# EAGLE design LM393 universal breakout (EAGLE 7.3.0)
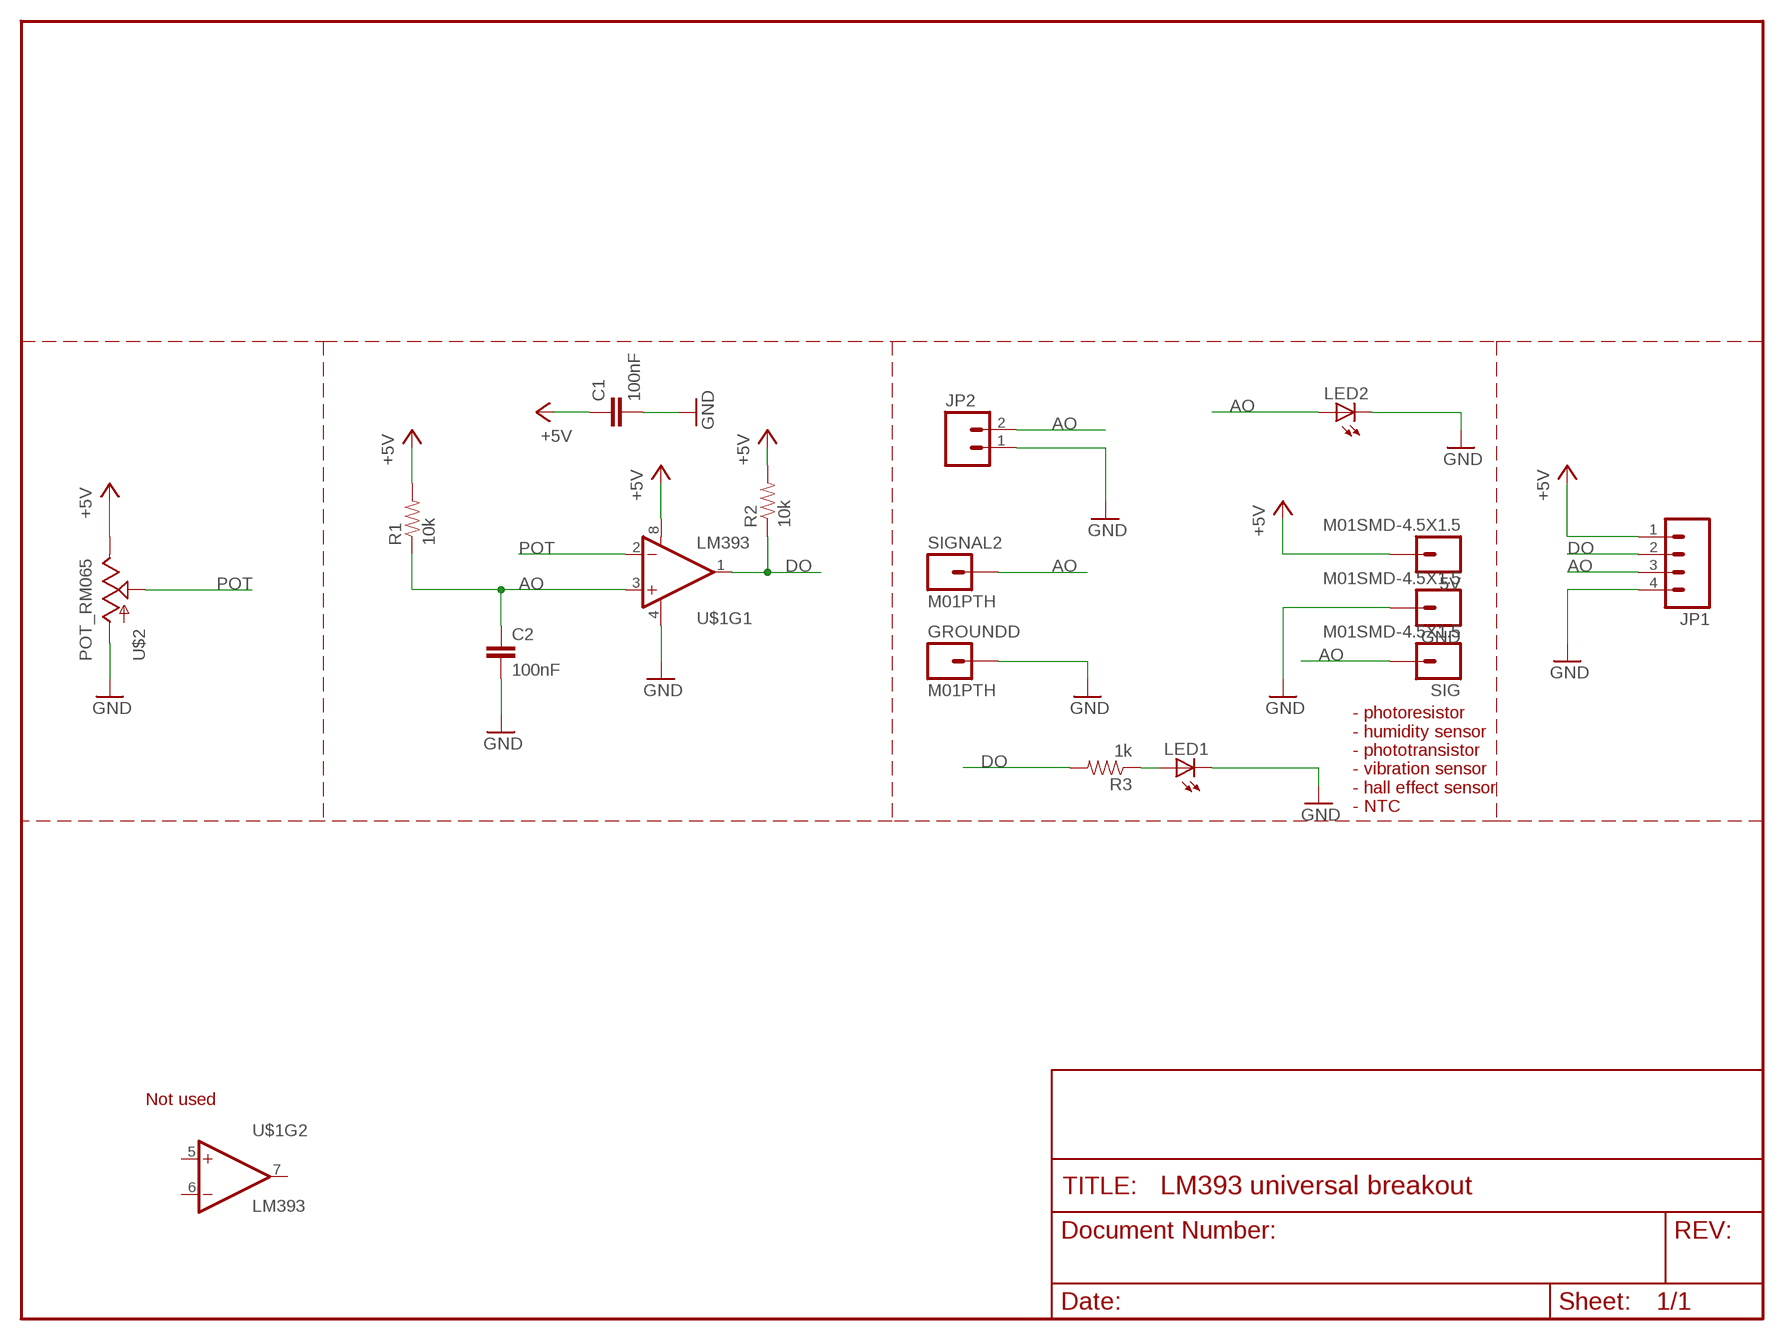
[diagram p0: schematic, sheet 1]

## Parts
5V  M01SMD-4.5X1.5  [PAD-1.5X4.5]
C1  100nF  CAP0603-CAP  [0603-CAP]
C2  100nF  CAP0603-CAP  [0603-CAP]
GND  M01SMD-4.5X1.5  [PAD-1.5X4.5]
GROUNDD  M01PTH  [1X01]
JP1  M04PTH  [1X04]
JP2  M02PTH  [1X02]
LED1  LEDCHIP-LED0805  [CHIP-LED0805]
LED2  LED5MM  [LED5MM]
R1  10k  RESISTOR0603-RES  [0603-RES]
R2  10k  RESISTOR0603-RES  [0603-RES]
R3  1k  RESISTOR0603-RES  [0603-RES]
SIG  M01SMD-4.5X1.5  [PAD-1.5X4.5]
SIGNAL2  M01PTH  [1X01]
U$1  LM393  [SO08]
U$2  POT_RM065  [RM065]

## Nets
+5V: 5V.P$1 C1.1 JP1.1 R1.2 R2.2 U$1.8(V+) U$2.3(E)
AO: C2.1 JP1.3 JP2.2 LED2.A R1.1 SIG.P$1 SIGNAL2.1 U$1.3(+IN)
DO: JP1.2 R2.1 R3.2 U$1.1(OUT)
GND: C1.2 C2.2 GND.P$1 GROUNDD.1 JP1.4 JP2.1 LED1.C LED2.K(C) U$1.4(V-) U$2.1(A)
N$1: LED1.A R3.1
POT: U$1.2(-IN) U$2.2(S)
Unconnected: U$1.5(+IN) U$1.6(-IN) U$1.7(OUT)

## Notes on the sheet
- - photoresistor
  - humidity sensor
  - phototransistor
  - vibration sensor
  - hall effect sensor
  - NTC
- Not used

## Library data of the parts
5V GND GROUNDD SIG SIGNAL2 = SparkFun:M01: Header 1 Standard 1-pin 0.1" header. Use with straight break away headers (SKU : PRT-00116), right angle break away headers (PRT-00553), swiss pins (PRT-00743), machine pins (PRT-00117), and female headers (PRT-00115).
C1 C2 = SparkFun:CAP: Capacitor Standard 0603 ceramic capacitor, and 0.1" leaded capacitor.
JP1 = SparkFun:M04: Header 4 Standard 4-pin 0.1" header. Use with straight break away headers (SKU : PRT-00116), right angle break away headers (PRT-00553), swiss pins (PRT-00743), machine pins (PRT-00117), and female headers (PRT-00115). Molex polarized connector foot print use with SKU : PRT-08231 with associated crimp pins and housings. 1MM SMD Version SKU: PRT-10208
JP2 = SparkFun:M02: Header 2 Standard 2-pin 0.1" header. Use with straight break away headers (SKU : PRT-00116), right angle break away headers (PRT-00553), swiss pins (PRT-00743), machine pins (PRT-00117), and female headers (PRT-00115). Molex polarized connector foot print use with SKU : PRT-08233 with associated crimp pins and housings.
LED1 LED2 = adafruit:LED: LED OSRAM: - CHIPLED LG R971, LG N971, LY N971, LG Q971, LY Q971, LO R971, LY R971 LH N974, LH R974 LS Q976, LO Q976, LY Q976 LO Q996 - Hyper CHIPLED LW Q18S LB Q993, LB Q99A, LB R99A - SideLED LS A670, LO A670, LY A670, LG A670, LP A670 LB A673, LV A673, LT A673, LW A673 LH A674 LY A675 LS A676, LA A676, LO A676, LY A676, LW A676 LS A679, LY A679, LG A679 - Hyper Micro SIDELED® LS Y876, LA Y876, LO Y876, LY Y876 LT Y87S - SmartLED LW L88C, LW L88S LB L89C, LB L89S, LG L890 LS L89K, LO L89K, LY L89K LS L896, LA L896, LO L896, LY L896 - TOPLED LS T670, LO T670, LY T670, LG T670, LP T670 LSG T670, LSP T670, LSY T670, LOP T670, LYG T670 LG T671, LOG T671, LSG T671 LB T673, LV T673, LT T673, LW T673 LH T674 LS T676, LA T676, LO T676, LY T676, LB T676, LH T676, LSB T676, LW T676 LB T67C, LV T67C, LT T67C, LS T67K, LO T67K, LY T67K, LW E67C LS E67B, LA E67B, LO E67B, LY E67B, LB E67C, LV E67C, LT E67C LW T67C LS T679, LY T679, LG T679 LS T770, LO T770, LY T770, LG T770, LP T770 LB T773, LV T773, LT T773, LW T773 LH T774 LS E675, LA E675, LY E675, LS T675 LS T776, LA T776, LO T776, LY T776, LB T776 LHGB T686 LT T68C, LB T68C - Hyper Mini TOPLED® LB M676 - Mini TOPLED Santana® LG M470 LS M47K, LO M47K, LY M47K Source: http://www.osram.convergy.de/
R1-R3 = SparkFun:RESISTOR: Resistor Basic schematic elements and footprints for 0603, 1206, and PTH resistors.
U$1 = SparkFun:LM393
U$2 = SparkFun:POT_RM065

## Board
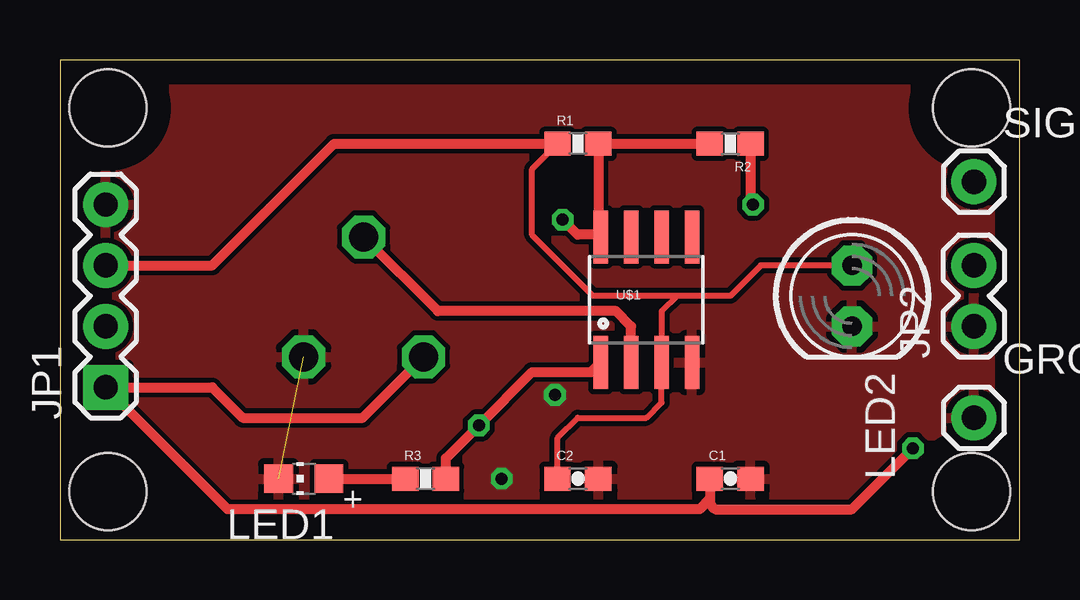
[diagram p1: board, top side]
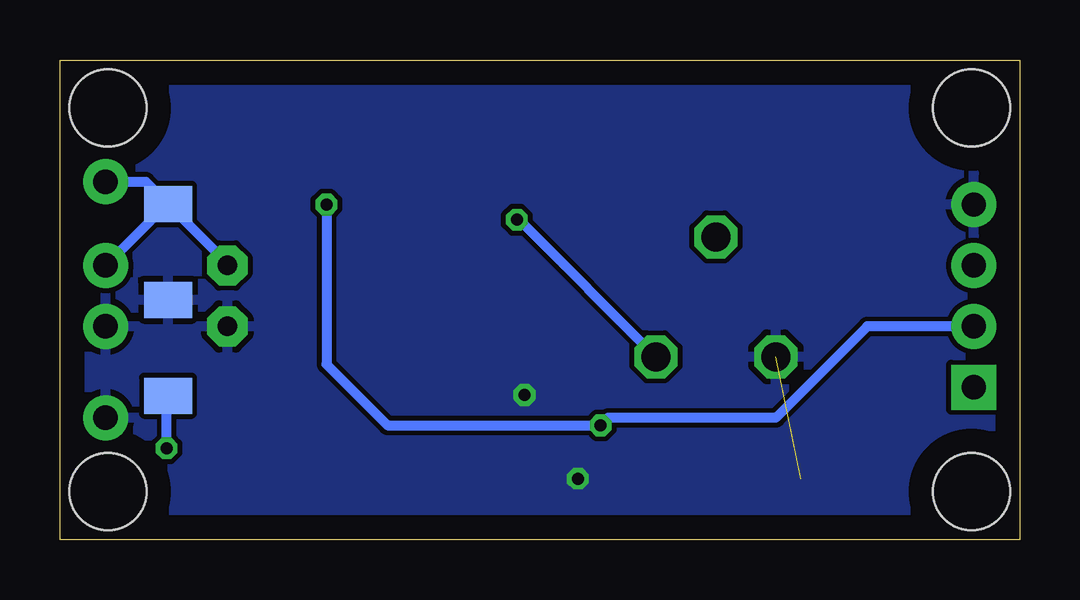
[diagram p2: board, bottom side, seen from below]

Size 40 x 20 mm. Coordinates in mm from the lower left corner, seen from the top.
Outline: 0,0 40,0 40,20 0,20 0,0
Copper layers (1*16): Top 0.035mm / dielectric 1.5mm / Bottom 0.035mm
Design rules "default *": minimum track width 10mil, minimum drill 24mil, track to track 8mil, track to pad 8mil, pad to pad 8mil, via to via 8mil, smd to smd 8mil, copper to edge 40mil, drill to drill 8mil, minimum pad ring 10mil, minimum via ring 8mil, stop-mask expansion 4mil, vias tented up to drill 5mm, thermal gap 10mil
Holes 3.2 mm at 2,2 2,18 38,18 38,2

### Footprints (pad centres in the part's own frame; a part is rotated, then mirrored left to right if it is on the bottom)
PAD-1.5X4.5 = smd 1.5 x 2: P$1 0,0
0603-CAP = smd 1.1 x 1: 1 -0.85,0; 2 0.85,0
1X01 = drill 1.016 pad 1.88: 1 0,0
1X04 = drill 1.016 pad 1.88 square: 1 0,0 | drill 1.016 pad 1.88: 2 2.54,0; 3 5.08,0; 4 7.62,0
1X02 = drill 1.016 pad 1.88: 1 0,0; 2 2.54,0
CHIP-LED0805 = smd 1.2 x 1.2: A 0,-1.05; C 0,1.05
LED5MM = drill 0.813 pad 1.676 octagon: A -1.27,0; K 1.27,0
0603-RES = smd 1.1 x 1: 1 -0.85,0; 2 0.85,0
SO08 = smd 0.61 x 2.21: 1 -1.905,-2.616; 2 -0.635,-2.616; 3 0.635,-2.616; 4 1.905,-2.616; 5 1.905,2.616; 6 0.635,2.616; 7 -0.635,2.616; 8 -1.905,2.616
RM065 = drill 1.2 octagon: 1 0,0; 2 2.5,5; 3 5,0

### Placement (x,y rotation side)
5V  35.5,6 90 bottom
C1  27.94,2.54 0 top
C2  21.59,2.54 0 top
GND  35.5,10 90 bottom
GROUNDD  38.1,5.08 0 top
JP1  1.91,6.35 90 top
JP2  38.1,8.89 90 top
LED1  10.16,2.54 90 top
LED2  33.02,10.16 270 top
R1  21.59,16.51 0 top
R2  27.94,16.51 180 top
R3  15.24,2.54 0 top
SIG  35.5,14 90 bottom
SIGNAL2  38.1,14.92 0 top
U$1  24.45,10 0 top
U$2  10.16,7.62 0 top
U$3  [NOVI_LOGO-4MM]  31.11,14.61 0 top
U$4  [OSH3MM]  31.75,3.17 0 top
U$5  [LUDI_LOGO_BACK]  18.41,4.45 0 top
U$6  [E-RADIONICA.COM_MADE_IN_BACK!]  5.71,0.64 0 top

### Tracks (layer width: path | path; a pad name or v marks a point on that pad's centre or on a via)
+5V  (via drill 0.5)
  Top 0.406: v35.56,3.81 33.02,1.27 27.3,1.27 27.09,1.49 C1.1 27.09,1.69 26.67,1.27 6.99,1.27 JP1.1 6.35,6.35 7.62,5.08 12.62,5.08 U$2.3 | R2.2 R1.2 22.44,12.72 | 22.44,12.72 U$1.8 | 22.44,12.72 21.57,12.72 v20.95,13.34
  Bottom 0.406: v35.56,3.81 35.56,5.94 5V.P$1 | v20.95,13.34 20.88,13.34 U$2.3
AO
  Top 0.254: LED2.A 29.21,11.43 27.94,10.16 25.72,10.16 | 25.72,10.16 25.08,9.53 U$1.3 25.08,5.71 24.45,5.08 21.59,5.08 20.74,4.23 C2.1 | 25.72,10.16 22.23,10.16 19.68,12.7 19.68,15.46 R1.1
  Top 0.406: JP1.3 6.35,11.43 11.43,16.51 R1.1
  Bottom 0.406: LED2.A 33.02,11.52 SIG.P$1 | SIG.P$1 35.53,14 JP2.2 | SIGNAL2.1 36.42,14.92 SIG.P$1
DO  (via drill 0.5)
  Top 0.406: R3.2 16.09,3.39 v17.46,4.76 19.68,6.99 22.14,6.99 U$1.1 | R2.1 28.79,14.07 v28.89,13.97
  Bottom 0.406: JP1.2 6.35,8.89 10.16,5.08 17.14,5.08 v17.46,4.76 26.35,4.76 28.89,7.3 v28.89,13.97
GND  (via drill 0.5)  (1 unrouted)
  other vias: 18.41,2.54 20.64,6.03
  pour Bottom: 0,0 40.01,0 40.01,19.68 0,19.68
  pour Top: 0,0 40.01,0 40.01,19.68 0,19.68
N$1
  Top 0.406: LED1.A R3.1
POT
  Top 0.406: U$1.2 23.81,8.89 23.18,9.53 15.76,9.53 U$2.2

### Text on the board
200bmp: LM393 breakout | gnd | AO | LM393 | DO | +5V